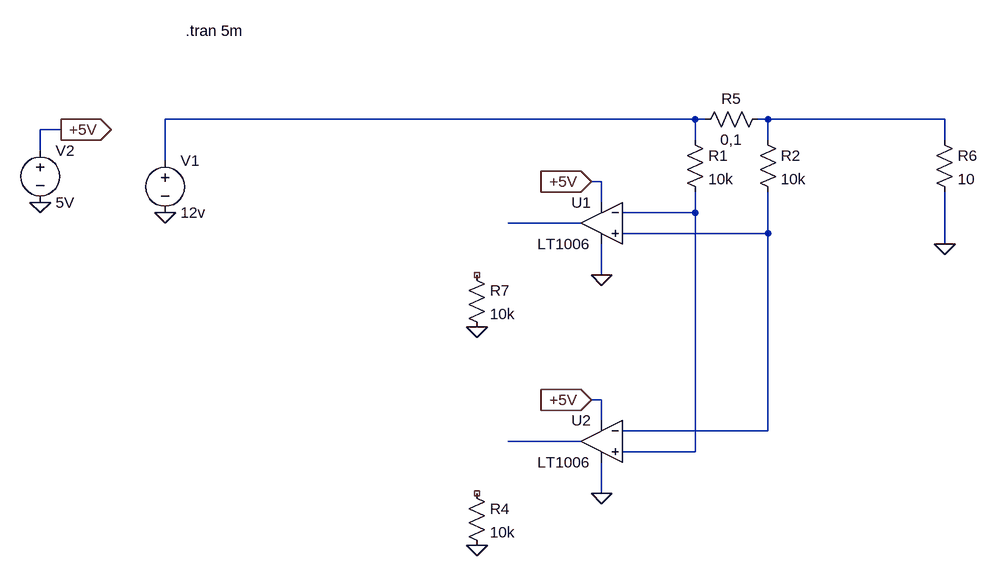
[diagram p0: schematic Meusure de courant bidir 4 (nw).asc]
Meusure de courant bidir 4 (nw).asc, the LTspice schematic file:
Version 4
SHEET 1 1092 884
WIRE 656 176 -160 176
WIRE 672 176 656 176
WIRE 768 176 752 176
WIRE 1040 176 768 176
WIRE -320 192 -352 192
WIRE 656 208 656 176
WIRE 768 208 768 176
WIRE 1040 208 1040 176
WIRE -352 224 -352 192
WIRE -160 240 -160 176
WIRE 512 272 496 272
WIRE 512 304 512 272
WIRE 656 320 656 288
WIRE 656 320 544 320
WIRE 480 336 368 336
WIRE 768 352 768 288
WIRE 768 352 544 352
WIRE 1040 368 1040 288
WIRE 512 416 512 368
WIRE 512 608 496 608
WIRE 512 640 512 608
WIRE 768 656 768 352
WIRE 768 656 544 656
WIRE 480 672 368 672
WIRE 656 688 656 320
WIRE 656 688 544 688
WIRE 512 752 512 704
FLAG -160 320 0
FLAG 1040 368 0
FLAG -320 192 +5V
IOPIN -320 192 Out
FLAG -352 304 0
FLAG 320 496 0
FLAG 496 272 +5V
IOPIN 496 272 In
FLAG 512 416 0
FLAG 320 832 0
FLAG 496 608 +5V
IOPIN 496 608 In
FLAG 512 752 0
SYMBOL OpAmps/LT1006 512 272 M0
SYMATTR InstName U1
SYMBOL res 768 160 R90
WINDOW 0 0 56 VBottom 2
WINDOW 3 32 56 VTop 2
SYMATTR InstName R5
SYMATTR Value 0,1
SYMBOL voltage -160 224 R0
SYMATTR InstName V1
SYMATTR Value 12v
SYMBOL res 1024 192 R0
SYMATTR InstName R6
SYMATTR Value 10
SYMBOL voltage -352 208 R0
SYMATTR InstName V2
SYMATTR Value 5V
SYMBOL res 304 400 R0
SYMATTR InstName R7
SYMATTR Value 10k
SYMBOL OpAmps/LT1006 512 608 M0
SYMATTR InstName U2
SYMBOL res 304 736 R0
SYMATTR InstName R4
SYMATTR Value 10k
SYMBOL res 640 192 R0
SYMATTR InstName R1
SYMATTR Value 10k
SYMBOL res 752 192 R0
SYMATTR InstName R2
SYMATTR Value 10k
TEXT -128 40 Left 2 !.tran 5m

The netlist it stands for:
* Meusure de courant bidir 4 (nw).asc
XU1 N005 N003 +5V 0 N004 LT1006  ; pins In+ In- V+ V- OUT
R5 N002 N001 0,1
V1 N001 0 12v
R6 N002 0 10
V2 +5V 0 5V
R7 NC_01 0 10k
XU2 N003 N005 +5V 0 N006 LT1006  ; pins In+ In- V+ V- OUT
R4 NC_02 0 10k
R1 N001 N003 10k
R2 N002 N005 10k
.tran 5m
.lib LTC.lib
.backanno
.end